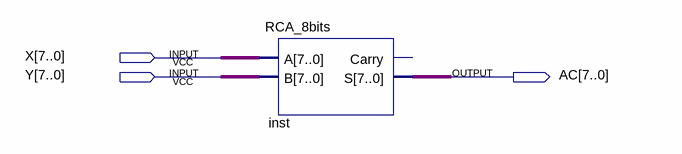
[diagram p0: schematic sheet]
// Quartus schematic adder.bdf as structural Verilog: 1 symbols, 3 pins
module adder (
  input  [7:0] X,
  input  [7:0] Y,
  output [7:0] AC
);

  RCA_8bits inst (.A(X), .B(Y), .S(AC));  // open: Carry
endmodule
